# EAGLE design mobileduino 2.0 (EAGLE 6.2)
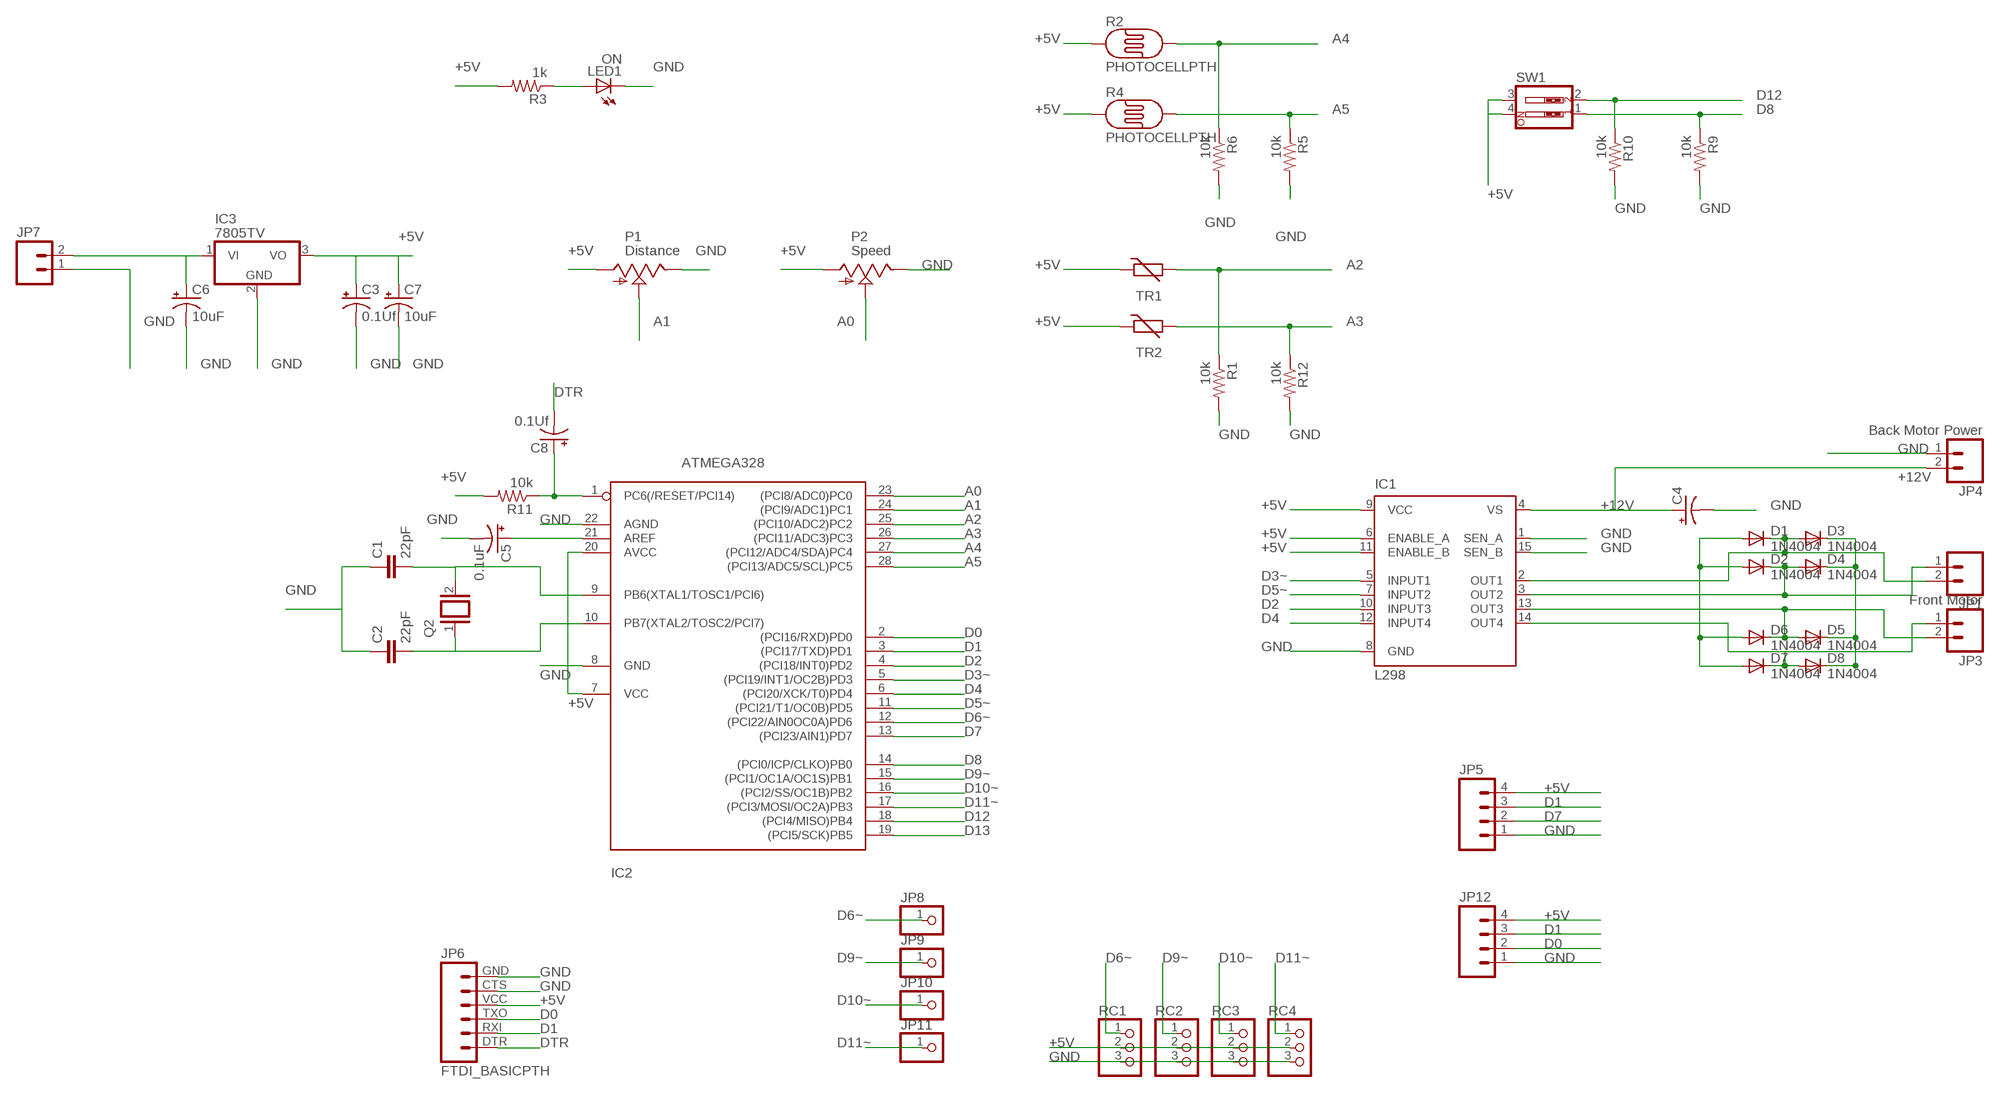
[diagram p0: schematic, sheet 1]

## Parts
C1  22pF  C5/2.5  [C5B2.5]
C2  22pF  C5/2.5  [C5B2.5]
C3  0.1Uf  CPOL-USTT2D5  [TT2D5]
C4  CPOL-USTT2D5  [TT2D5]
C5  0.1uF  CPOL-USTT2D5  [TT2D5]
C6  10uF  CPOL-USTT2D5  [TT2D5]
C7  10uF  CPOL-USTT2D5  [TT2D5]
C8  0.1Uf  CPOL-USTT2D5  [TT2D5]
D1  1N4004  [DO41-10]
D2  1N4004  [DO41-10]
D3  1N4004  [DO41-10]
D4  1N4004  [DO41-10]
D5  1N4004  [DO41-10]
D6  1N4004  [DO41-10]
D7  1N4004  [DO41-10]
D8  1N4004  [DO41-10]
IC1  L298  [MULTIWATT-15]
IC2  ATMEGA328  ATMEGA168V-10P  [DIL28-3]
IC3  7805TV  [TO220V]
JP1  M025MM  [SCREWTERMINAL-5MM-2]
JP3  Front Motor  M025MM  [SCREWTERMINAL-5MM-2]
JP4  Back Motor Power  M025MM  [SCREWTERMINAL-5MM-2]
JP5  M04PTH  [1X04]
JP6  FTDI_BASICPTH  [FTDI_BASIC]
JP7  M025MM  [SCREWTERMINAL-5MM-2]
JP8  PINHD-1X1  [1X01]
JP9  PINHD-1X1  [1X01]
JP10  PINHD-1X1  [1X01]
JP11  PINHD-1X1  [1X01]
JP12  M04PTH  [1X04]
LED1  ON  LED3MM  [LED3MM]
P1  Distance  TRIM_US-CA6V  [CA6V]
P2  Speed  TRIM_US-CA6V  [CA6V]
Q2  XTAL/S  [QS]
R1  10k  R-US_0204/2V  [0204V]
R2  PHOTOCELLPTH  [PHOTOCELL]
R3  1k  R-US_0204/2V  [0204V]
R4  PHOTOCELLPTH  [PHOTOCELL]
R5  10k  R-US_0204/2V  [0204V]
R6  10k  R-US_0204/2V  [0204V]
R9  10k  R-US_0204/2V  [0204V]
R10  10k  R-US_0204/2V  [0204V]
R11  10k  R-US_0204/2V  [0204V]
R12  10k  R-US_0204/2V  [0204V]
RC1  PINHD-1X3  [1X03]
RC2  PINHD-1X3  [1X03]
RC3  PINHD-1X3  [1X03]
RC4  PINHD-1X3  [1X03]
SW1  SW_DIP-2  [EDG-02]
TR1  THERMISTOR_R-2,5  [RS-2,5]
TR2  THERMISTOR_R-2,5  [RS-2,5]

## Nets
+5V: C3.+ C7.+ IC1.6(ENABLE_A) IC1.9(VCC) IC1.11(ENABLE_B) IC2.7(VCC) IC2.20(AVCC) IC3.3(VO) JP5.4 JP6.VCC JP12.4 P1.A P2.A R2.1 R3.2 R4.1 R11.2 RC1.2 RC2.2 RC3.2 RC4.2 SW1.3 SW1.4 TR1.1 TR2.1
+12V: C4.+ IC1.4(VS) JP4.2
A0: IC2.23((PCI8/ADC0)PC0) P2.S
A1: IC2.24((PCI9/ADC1)PC1) P1.S
A2: IC2.25((PCI10/ADC2)PC2) R1.1 TR1.2
A3: IC2.26((PCI11/ADC3)PC3) R12.1 TR2.2
A4: IC2.27((PCI12/ADC4/SDA)PC4) R2.2 R6.1
A5: IC2.28((PCI13/ADC5/SCL)PC5) R4.2 R5.1
D0: IC2.2((PCI16/RXD)PD0) JP6.TXO JP12.2
D1: IC2.3((PCI17/TXD)PD1) JP5.3 JP6.RXI JP12.3
D2: IC1.10(INPUT3) IC2.4((PCI18/INT0)PD2)
D3~: IC1.5(INPUT1) IC2.5((PCI19/INT1/OC2B)PD3)
D4: IC1.12(INPUT4) IC2.6((PCI20/XCK/T0)PD4)
D5~: IC1.7(INPUT2) IC2.11((PCI21/T1/OC0B)PD5)
D6~: IC2.12((PCI22/AIN0OC0A)PD6) JP8.1 RC1.1
D7: IC2.13((PCI23/AIN1)PD7) JP5.2
D8: IC2.14((PCI0/ICP/CLKO)PB0) R9.1 SW1.1
D9~: IC2.15((PCI1/OC1A/OC1S)PB1) JP9.1 RC2.1
D10~: IC2.16((PCI2/SS/OC1B)PB2) JP10.1 RC3.1
D11~: IC2.17((PCI3/MOSI/OC2A)PB3) JP11.1 RC4.1
D12: IC2.18((PCI4/MISO)PB4) R10.1 SW1.2
D13: IC2.19((PCI5/SCK)PB5)
DTR: C8.- JP6.DTR
GND: C1.1 C2.1 C3.- C4.- C5.- C6.- C7.- IC1.1(SEN_A) IC1.8(GND) IC1.15(SEN_B) IC2.8(GND) IC2.22(AGND) IC3.2(GND) JP4.1 JP5.1 JP6.CTS JP6.GND JP7.1 JP12.1 LED1.K(C) P1.E P2.E R1.2 R5.2 R6.2 R9.2 R10.2 R12.2 RC1.3 RC2.3 RC3.3 RC4.3
N$1: D1.C D3.A IC1.2(OUT1) JP1.2
N$2: C8.+ IC2.1(PC6(/RESET/PCI14)) R11.1
N$3: C2.2 IC2.10(PB7(XTAL2/TOSC2/PCI7)) Q2.1
N$4: D2.C D4.A IC1.3(OUT2) JP1.1
N$5: D5.A D6.C IC1.13(OUT3) JP3.2
N$6: D7.C D8.A IC1.14(OUT4) JP3.1
N$7: C6.+ IC3.1(VI) JP7.2
N$8: C1.2 IC2.9(PB6(XTAL1/TOSC1/PCI6)) Q2.2
N$9: C5.+ IC2.21(AREF)
N$18: D3.C D4.C D5.C D8.C
N$27: D1.A D2.A D6.A D7.A
N$33: LED1.A R3.1

## Library data of the parts
C1 C2 = capacitor-wima:C: CAPACITOR naming: grid - package width
C3-C8 = adafruit:CPOL-US: POLARIZED CAPACITOR, American symbol
D1-D8 = adafruit:1N4004: DIODE General purpose 1N400x type rectifier (With bigger pads) http://www.ladyada.net/library/pcb/eaglelibrary.html
IC1 = st-microelectronics:L298: DUAL FULL-BRIDGE DRIVER
IC2 = adafruit:ATMEGA168*P: MICROCONTROLLER 16 kBytes FLASH 1 kBytes SRAM 512 Bytes EEPROM USART 8-channel 10 bit ADC
IC3 = linear:78*: Positive VOLTAGE REGULATOR Source: http://cache.national.com/ds/LM/LM78L05.pdf http://www.fairchildsemi.com/ds/LM/LM7805.pdf
JP1 JP3 JP4 JP7 = SparkFun-Connectors:M02: Header 2 Standard 2-pin 0.1" header. Use with straight break away headers (SKU : PRT-00116), right angle break away headers (PRT-00553), swiss pins (PRT-00743), machine pins (PRT-00117), and female headers (PRT-00115). Molex polarized connector foot print use with SKU : PRT-08233 with associated crimp pins and housings.
JP5 JP12 = SparkFun-Connectors:M04: Header 4 Standard 4-pin 0.1" header. Use with straight break away headers (SKU : PRT-00116), right angle break away headers (PRT-00553), swiss pins (PRT-00743), machine pins (PRT-00117), and female headers (PRT-00115). Molex polarized connector foot print use with SKU : PRT-08231 with associated crimp pins and housings. 1MM SMD Version SKU: PRT-10208
JP6 = SparkFun-Connectors:FTDI_BASIC: FTDI Basic header with labels
JP8-JP11 = adafruit:PINHD-1X1: Pin header 1x1 for 0.1" spacing With round pins
LED1 = adafruit:LED: LED OSRAM: - CHIPLED LG R971, LG N971, LY N971, LG Q971, LY Q971, LO R971, LY R971 LH N974, LH R974 LS Q976, LO Q976, LY Q976 LO Q996 - Hyper CHIPLED LW Q18S LB Q993, LB Q99A, LB R99A - SideLED LS A670, LO A670, LY A670, LG A670, LP A670 LB A673, LV A673, LT A673, LW A673 LH A674 LY A675 LS A676, LA A676, LO A676, LY A676, LW A676 LS A679, LY A679, LG A679 - Hyper Micro SIDELED® LS Y876, LA Y876, LO Y876, LY Y876 LT Y87S - SmartLED LW L88C, LW L88S LB L89C, LB L89S, LG L890 LS L89K, LO L89K, LY L89K LS L896, LA L896, LO L896, LY L896 - TOPLED LS T670, LO T670, LY T670, LG T670, LP T670 LSG T670, LSP T670, LSY T670, LOP T670, LYG T670 LG T671, LOG T671, LSG T671 LB T673, LV T673, LT T673, LW T673 LH T674 LS T676, LA T676, LO T676, LY T676, LB T676, LH T676, LSB T676, LW T676 LB T67C, LV T67C, LT T67C, LS T67K, LO T67K, LY T67K, LW E67C LS E67B, LA E67B, LO E67B, LY E67B, LB E67C, LV E67C, LT E67C LW T67C LS T679, LY T679, LG T679 LS T770, LO T770, LY T770, LG T770, LP T770 LB T773, LV T773, LT T773, LW T773 LH T774 LS E675, LA E675, LY E675, LS T675 LS T776, LA T776, LO T776, LY T776, LB T776 LHGB T686 LT T68C, LB T68C - Hyper Mini TOPLED® LB M676 - Mini TOPLED Santana® LG M470 LS M47K, LO M47K, LY M47K Source: http://www.osram.convergy.de/
P1 P2 = pot:TRIM_US-: POTENTIOMETER
Q2 = special:XTAL/S: CRYSTAL
R1 R3 R5 R6 R9-R12 = adafruit:R-US_: RESISTOR, American symbol
R2 R4 = SparkFun-Sensors:PHOTOCELL: CdS photoresistor. This is a low cost way to detect light levels. Resistance decreases with more incoming light. SparkFun SKU: SEN-09088
RC1-RC4 = adafruit:PINHD-1X3: PIN HEADER
SW1 = special:SW_DIP-2: DIP SWITCH
TR1 TR2 = discrete:THERMISTOR_: Thermo Resistor

## Board
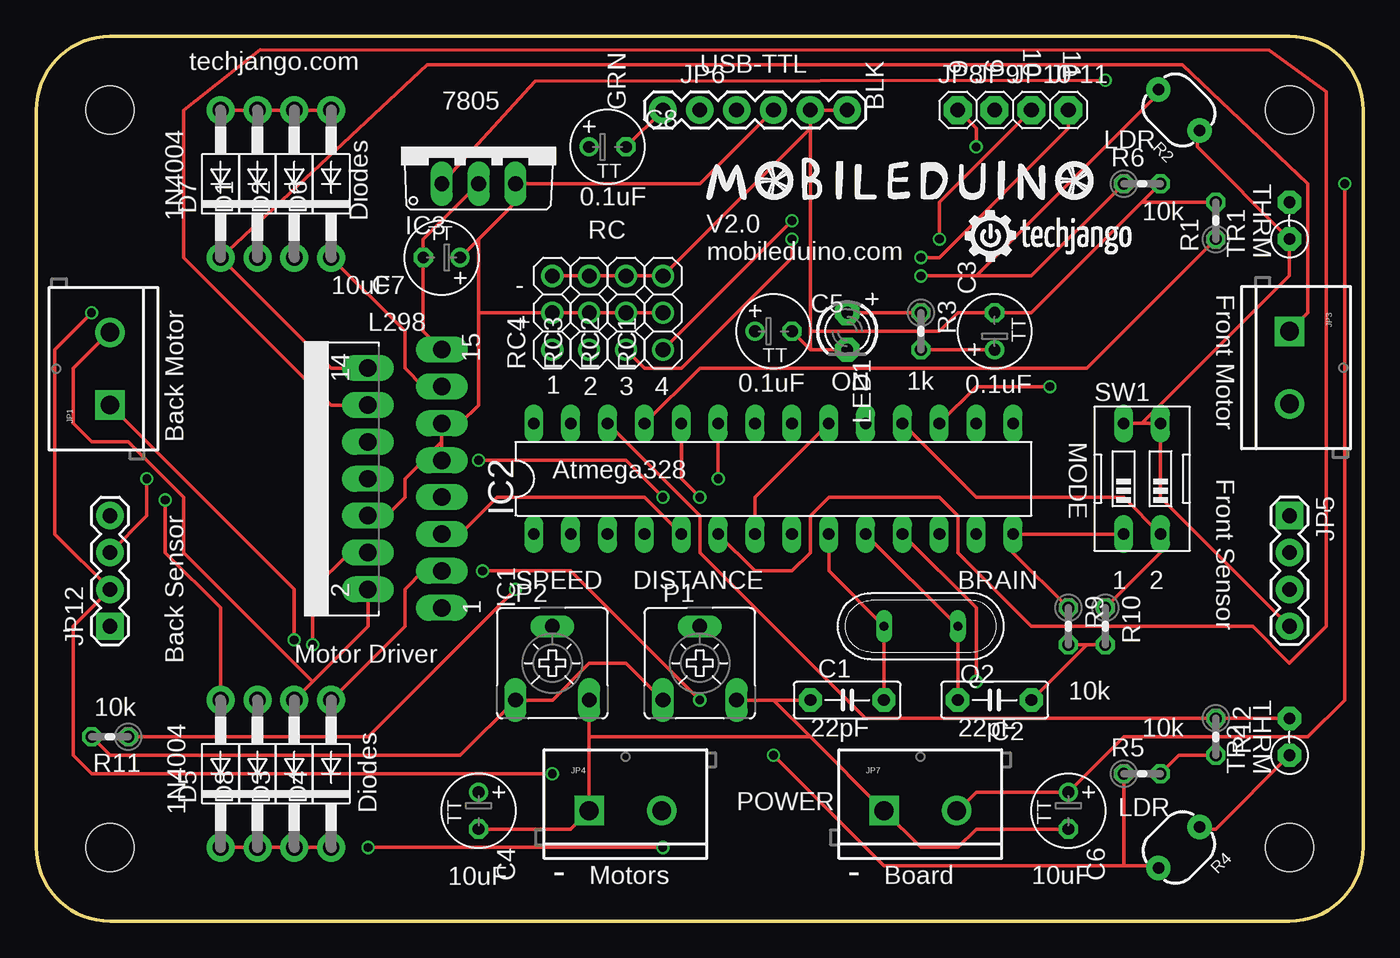
[diagram p1: board, top side]
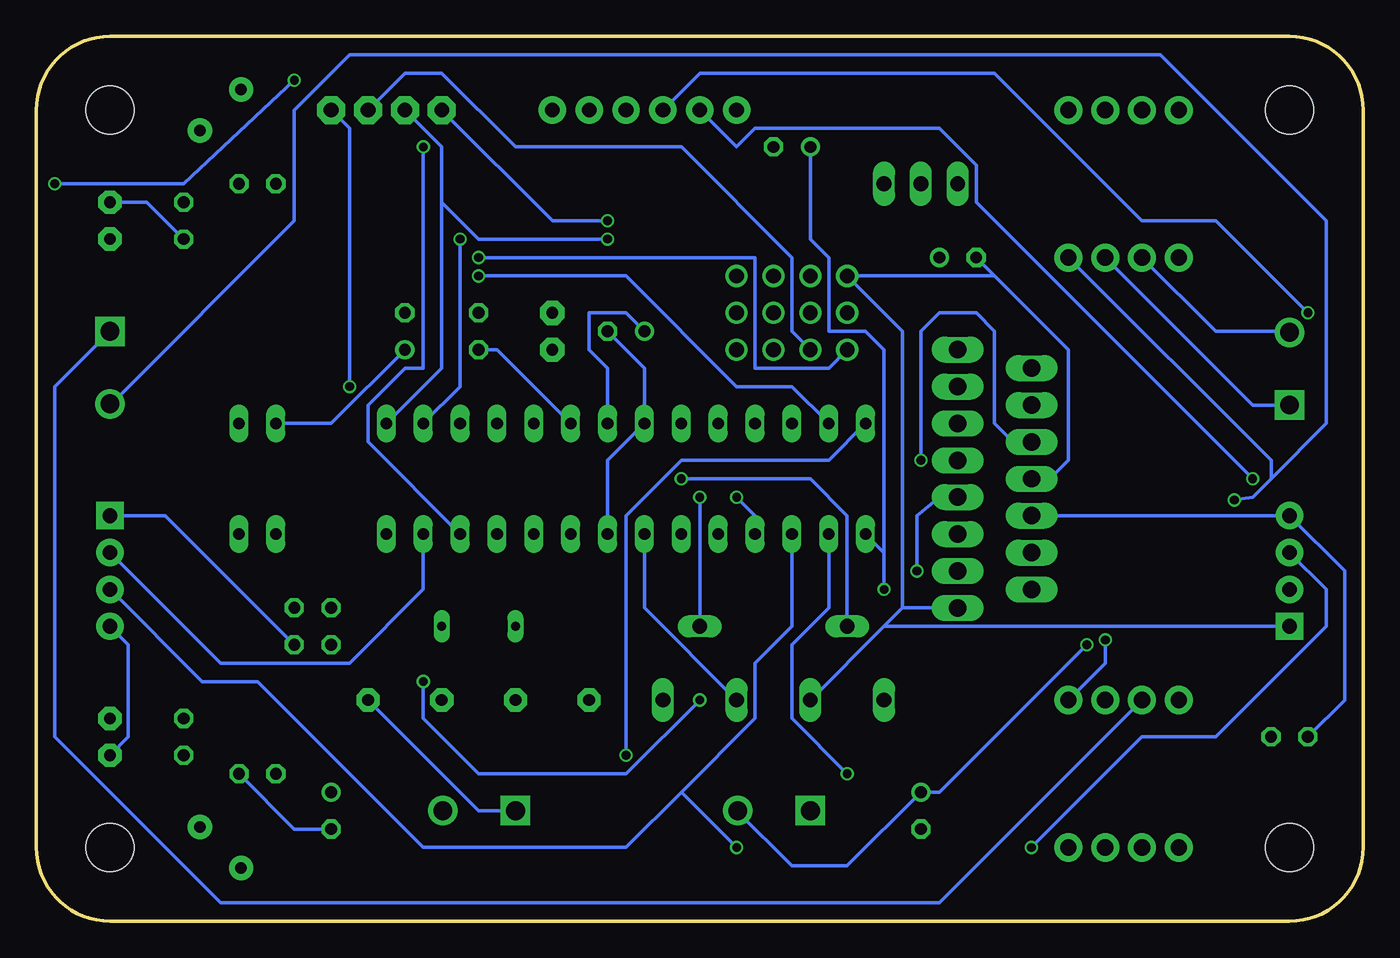
[diagram p2: board, bottom side, seen from below]

Size 91.44 x 60.96 mm. Coordinates in mm from the lower left corner, seen from the top.
Outline: 0,55.88 arc-90 5.08,60.96 86.36,60.96 arc-90 91.44,55.88 91.44,5.08 arc-90 86.36,0 5.08,0 arc-90 0,5.08 0,55.88
Copper layers (1*16): Top 0.035mm / dielectric 1.5mm / Bottom 0.035mm
Design rules: minimum track width 6mil, minimum drill 12mil, track to track 6mil, track to pad 6mil, pad to pad 6mil, via to via 6mil, smd to smd 0mil, copper to edge 10mil, drill to drill 10mil, minimum pad ring 10mil, minimum via ring 6mil, stop-mask expansion 2mil, vias tented up to drill 100mil, thermal gap 10mil

### Footprints (pad centres in the part's own frame; a part is rotated, then mirrored left to right if it is on the bottom)
C5B2.5 = drill 0.813 pad 1.6 octagon: 1 -2.54,0; 2 2.54,0
TT2D5 = drill 0.813: + -1.27,0 | drill 0.813 octagon: - 1.27,0
DO41-10 = drill 1.118 pad 1.93: A 5.08,0; C -5.08,0
MULTIWATT-15 = drill 1.2 long: 1 -8.89,-7.62; 2 -7.62,-2.54; 3 -6.35,-7.62; 4 -5.08,-2.54; 5 -3.81,-7.62; 6 -2.54,-2.54; 7 -1.27,-7.62; 8 0,-2.54; 9 1.27,-7.62; 10 2.54,-2.54; 11 3.81,-7.62; 12 5.08,-2.54; 13 6.35,-7.62; 14 7.62,-2.54; 15 8.89,-7.62
DIL28-3 = drill 0.813 long: 1 -16.51,-3.81; 2 -13.97,-3.81; 3 -11.43,-3.81; 4 -8.89,-3.81; 5 -6.35,-3.81; 6 -3.81,-3.81; 7 -1.27,-3.81; 8 1.27,-3.81; 9 3.81,-3.81; 10 6.35,-3.81; 11 8.89,-3.81; 12 11.43,-3.81; 13 13.97,-3.81; 14 16.51,-3.81; 15 16.51,3.81; 16 13.97,3.81; 17 11.43,3.81; 18 8.89,3.81; 19 6.35,3.81; 20 3.81,3.81; 21 1.27,3.81; 22 -1.27,3.81; 23 -3.81,3.81; 24 -6.35,3.81; 25 -8.89,3.81; 26 -11.43,3.81; 27 -13.97,3.81; 28 -16.51,3.81
TO220V = drill 1.016 long: 1 -2.54,-2.54; 2 0,-2.54; 3 2.54,-2.54
SCREWTERMINAL-5MM-2 = drill 1.3 pad 2.032 square: 1 0,0 | drill 1.3 pad 2.032: 2 5,0
1X04 = drill 1.016 pad 1.88 square: 1 0,0 | drill 1.016 pad 1.88: 2 2.54,0; 3 5.08,0; 4 7.62,0
FTDI_BASIC = drill 1.016 pad 1.88: CTS 10.16,0; DTR 0,0; GND 12.7,0; RXI 2.54,0; TXO 5.08,0; VCC 7.62,0
1X01 = drill 1.016 pad 1.93 octagon: 1 0,0
LED3MM = drill 0.813 pad 1.676 octagon: A -1.27,0; K 1.27,0
CA6V = drill 1.016 long: A -2.54,-2.54; E 2.54,-2.54; S 0,2.54
QS = drill 0.61 long: 1 -2.54,0; 2 2.54,0
0204V = drill 0.813 octagon: 1 -1.27,0; 2 1.27,0
PHOTOCELL = drill 0.8 pad 1.676: 1 -2,0; 2 2,0
1X03 = drill 1.016: 1 -2.54,0; 2 0,0; 3 2.54,0
EDG-02 = drill 0.813 long: 1 -1.27,-3.81; 2 1.27,-3.81; 3 1.27,3.81; 4 -1.27,3.81
RS-2,5 = drill 0.813 pad 1.6 octagon: 1 -1.27,0; 2 1.27,0
STAND-OFF = hole 3.302: 0,0

### Placement (x,y rotation side)
C1  55.88,15.24 0 top
C2  66.04,15.24 180 top
C3  66.04,40.64 90 top
C4  30.48,7.62 270 top
C5  50.8,40.64 0 top
C6  71.12,7.62 270 top
C7  27.94,45.72 180 top
C8  39.37,53.34 0 top
D1  15.24,50.8 90 top
D2  17.78,50.8 90 top
D3  17.78,10.16 90 top
D4  20.32,10.16 90 top
D5  12.7,10.16 90 top
D6  20.32,50.8 90 top
D7  12.7,50.8 90 top
D8  15.24,10.16 90 top
IC1  20.32,30.48 90 top
IC2  50.8,30.48 0 top
IC3  30.48,53.34 0 top
JP1  5.08,35.56 90 top
JP3  86.36,40.64 270 top
JP4  38.1,7.62 0 top
JP5  86.36,27.94 270 top
JP6  43.18,55.88 0 top
JP7  58.42,7.62 0 top
JP8  63.5,55.88 0 top
JP9  66.04,55.88 0 top
JP10  68.58,55.88 0 top
JP11  71.12,55.88 0 top
JP12  5.08,20.32 90 top
LED1  55.88,40.64 270 top
P1  45.72,17.78 0 top
P2  35.56,17.78 0 top
Q2  60.96,20.32 180 top
R1  81.28,48.26 90 top
R2  78.74,55.88 135 top
R3  60.96,40.64 270 top
R4  78.74,5.08 225 top
R5  76.2,10.16 0 top
R6  76.2,50.8 0 top
R9  71.12,20.32 270 top
R10  73.66,20.32 270 top
R11  5.08,12.7 180 top
R12  81.28,12.7 270 top
RC1  43.18,41.91 90 top
RC2  40.64,41.91 90 top
RC3  38.1,41.91 90 top
RC4  35.56,41.91 90 top
SW1  76.2,30.48 0 top
TR1  86.36,48.26 90 top
TR2  86.36,12.7 90 top
U$1  [STAND-OFF]  5.08,55.88 0 top
U$2  [STAND-OFF]  5.08,5.08 0 top
U$3  [STAND-OFF]  86.36,5.08 0 top
U$4  [STAND-OFF]  86.36,55.88 0 top

### Tracks (layer width: path | path; a pad name or v marks a point on that pad's centre or on a via)
+5V
  Top 0.254: R11.2 5.08,11.43 29.21,11.43 P2.A 35.56,15.24 38.1,17.78 40.64,17.78 P1.A | RC1.2 RC2.2 RC3.2 RC4.2 30.48,41.91 | 27.94,33.02 IC1.11 29.21,34.29 30.48,35.56 30.48,41.91 | 27.94,33.02 IC1.9 | 30.48,46.99 33.02,49.53 IC3.3 45.72,50.8 JP6.VCC | 30.48,46.99 C7.+ | 30.48,46.99 30.48,41.91 | IC1.6 24.13,27.94 25.4,29.21 25.4,30.48 27.94,33.02 | IC2.7 49.53,29.21 IC2.20 | R2.1 80.01,54.61 80.01,53.34 TR1.1 86.36,44.45 76.2,34.29 | TR2.1 81.28,6.35 80.01,6.35 R4.1 | 76.2,34.29 SW1.3 77.47,29.21 JP5.4 | 76.2,34.29 SW1.4 | C3.+ R3.2
  Bottom 0.254: IC1.6 JP12.4 1.27,24.13 1.27,15.24 R11.2 | P1.A 49.53,21.59 IC2.7 | SW1.4 71.12,34.29 C3.+ | TR2.1 85.09,12.7 85.09,19.05 JP5.4 | IC2.20 59.69,39.37 R3.2
+12V  (via drill 0.6)
  Top 0.254: IC1.4 21.59,25.4 19.05,22.86 v19.05,19.05
  Bottom 0.254: JP4.2 43.18,7.62 39.37,3.81 35.56,3.81 C4.+ 29.21,8.89 v19.05,19.05
A0  (via drill 0.6)
  Top 0.254: v46.99,30.48 IC2.23
  Bottom 0.254: v46.99,30.48 38.1,30.48 35.56,27.94 P2.S
A1  (via drill 0.6)
  Top 0.254: IC2.24 44.45,30.48 v45.72,29.21
  Bottom 0.254: P1.S v45.72,29.21
A2
  Top 0.254: IC2.25 45.72,38.1 72.39,38.1 R1.1
  Bottom 0.254: TR1.2 83.82,49.53 R1.1
A3
  Top 0.254: IC2.26 45.72,27.94 45.72,25.4 57.15,13.97 R12.1 TR2.2
A4  (via drill 0.6)
  Top 0.254: 64.77,44.45 68.58,44.45 R6.1 | 64.77,44.45 v60.96,44.45 | 64.77,44.45 77.47,57.15 R2.2
  Bottom 0.254: IC2.27 39.37,36.83 43.18,36.83 50.8,44.45 v60.96,44.45
A5  (via drill 0.6)
  Top 0.254: v50.8,11.43 58.42,3.81 74.93,3.81 | 74.93,3.81 77.47,3.81 R4.2 | 74.93,3.81 R5.1
  Bottom 0.254: IC2.28 36.83,31.75 46.99,31.75 50.8,27.94 v50.8,11.43
D0  (via drill 0.6)
  Top 0.254: v35.56,10.16 3.81,10.16 2.54,11.43 2.54,20.32 JP12.2 1.27,26.67 1.27,39.37 v3.81,41.91
  Bottom 0.254: IC2.2 36.83,21.59 39.37,19.05 39.37,13.97 v35.56,10.16 | JP6.TXO 45.72,58.42 25.4,58.42 15.24,48.26 10.16,48.26 v3.81,41.91
D1  (via drill 0.6)
  Top 0.254: JP12.3 7.62,27.94 v7.62,30.48 | v22.86,5.08 v43.18,5.08
  Bottom 0.254: IC2.3 39.37,20.32 41.91,17.78 41.91,13.97 46.99,8.89 | 46.99,8.89 50.8,5.08 64.77,5.08 76.2,16.51 80.01,16.51 JP5.3 | v7.62,30.48 26.67,49.53 26.67,52.07 29.21,54.61 41.91,54.61 43.18,53.34 JP6.RXI | v43.18,5.08 46.99,8.89 | v22.86,5.08 15.24,12.7 10.16,12.7 2.54,20.32 2.54,22.86 JP12.3
D2  (via drill 0.6)
  Top 0.254: v43.18,29.21 40.64,31.75 v30.48,31.75
  Bottom 0.254: IC2.4 41.91,27.94 v43.18,29.21 | v30.48,31.75 30.48,40.64 29.21,41.91 26.67,41.91 25.4,40.64 25.4,34.29 24.13,33.02 IC1.10
D3~
  Top 0.254: IC2.5 41.91,29.21 31.75,29.21 29.21,26.67 IC1.5
D4
  Top 0.254: IC2.6 49.53,24.13 52.07,24.13 53.34,25.4 53.34,27.94 54.61,29.21 62.23,29.21 63.5,27.94 63.5,25.4 68.58,20.32 83.82,20.32 86.36,17.78 88.9,20.32 88.9,57.15 84.97,60.01 15.41,60.02 10.16,55.88 10.16,45.72 20.32,35.56 IC1.12
D5~  (via drill 0.6)
  Top 0.254: IC2.11 64.77,21.59 v64.77,16.51 | v45.72,15.24 36.83,24.13 v30.76,24.13
  Bottom 0.254: v64.77,16.51 64.77,13.97 60.96,10.16 50.8,10.16 v45.72,15.24 | v30.76,24.13 30.76,27.92 29.21,29.21 IC1.7
D6~  (via drill 0.6)
  Top 0.254: v64.77,53.34 64.77,54.61 JP8.1 | v52.07,48.26 RC1.1
  Bottom 0.254: IC2.12 68.58,33.02 68.58,35.56 66.04,38.1 64.77,38.1 v64.77,53.34 | v52.07,48.26 55.88,48.26 JP8.1
D7
  Bottom 0.254: IC2.13 64.77,22.86 69.85,17.78 78.74,17.78 JP5.2
D8
  Top 0.254: R9.1 67.31,25.4 IC2.14 SW1.1
D9~  (via drill 0.6)
  Top 0.254: RC2.1 41.91,38.1 44.45,38.1 52.07,45.72 v52.07,46.99
  Bottom 0.254: IC2.15 63.5,38.1 63.5,49.53 | 63.5,49.53 63.5,53.34 JP9.1 | v52.07,46.99 60.96,46.99 63.5,49.53
D10~  (via drill 0.6)
  Top 0.254: v62.23,46.99 62.23,49.53 JP10.1
  Bottom 0.254: IC2.16 62.23,36.83 v62.23,46.99 | RC3.1 39.37,40.64 39.37,45.72 46.99,53.34 58.42,53.34 63.5,58.42 66.04,58.42 JP10.1
D11~  (via drill 0.6)
  Top 0.254: IC2.17 64.77,36.83 v69.85,36.83 | v60.96,45.72 62.23,45.72 71.12,54.61 JP11.1
  Bottom 0.254: v69.85,36.83 69.85,54.61 JP11.1 | RC4.1 36.83,38.1 41.91,38.1 41.91,45.72 v60.96,45.72
D12
  Top 0.254: IC2.18 64.77,29.21 74.93,29.21 SW1.2 77.47,25.4 R10.1
DTR
  Top 0.254: JP6.DTR C8.-
GND
  Top 0.254: RC4.3 RC3.3 RC2.3 RC1.3 53.34,54.61 | IC1.15 26.67,40.64 C7.- 26.67,46.99 IC3.2 | R6.2 76.2,49.53 | 76.2,49.53 68.58,41.91 C3.- 63.5,41.91 62.23,40.64 53.34,40.64 | 76.2,49.53 R1.2 | JP6.GND JP6.CTS 53.34,54.61 | 53.34,39.37 LED1.K | C5.- 53.34,39.37 | 53.34,39.37 53.34,40.64 | 53.34,40.64 53.34,54.61 | C4.- 36.83,6.35 JP4.1 38.1,12.7 | 38.1,12.7 P2.E | R10.2 72.39,19.05 | 72.39,19.05 R9.2 | 72.39,19.05 C2.1 | R12.2 78.74,11.43 R5.2 | C1.1 50.8,15.24 | 50.8,15.24 P1.E | 50.8,15.24 53.34,12.7 | 53.34,12.7 JP7.1 60.96,5.08 63.5,5.08 64.77,6.35 C6.- | 53.34,12.7 38.1,12.7
  Bottom 0.254: IC1.8 21.59,30.48 20.32,31.75 20.32,39.37 25.4,44.45 | C7.- 25.4,44.45 | 25.4,44.45 RC4.3 31.75,40.64 31.75,21.59 | C5.- 49.53,38.1 IC2.22 52.07,31.75 IC2.8 | 31.75,21.59 IC1.1 | P2.E 33.02,20.32 | 33.02,20.32 31.75,21.59 | 33.02,20.32 JP12.1 | JP5.1 82.55,27.94 R10.2 | C6.- 73.66,6.35 R5.2 | C2.1 60.96,7.62 JP7.1
N$1
  Top 0.254: IC1.2 22.86,20.32 19.05,16.51 | D3.A 19.05,16.51 | 19.05,16.51 10.16,25.4 10.16,29.21 6.35,33.02 3.81,33.02 2.54,34.29 2.54,38.1 5.08,40.64 JP1.2
  Bottom 0.254: D1.C 10.16,40.64 5.08,40.64 JP1.2
N$2  (via drill 0.6)
  Top 0.254: R11.1 22.86,12.7 v33.02,22.86
  Bottom 0.254: 33.02,25.4 v33.02,22.86 | IC2.1 33.02,25.4 | C8.+ 38.1,46.99 36.83,45.72 36.83,40.64 34.29,40.64 33.02,39.37 33.02,25.4
N$3
  Top 0.254: C2.2 Q2.1 IC2.10
N$4  (via drill 0.6)
  Top 0.254: IC1.3 26.67,24.13 25.4,22.86 25.4,20.32 D4.A | v17.76,19.38 17.78,22.86 JP1.1
  Bottom 0.254: D2.C 7.62,35.56 JP1.1 | D4.A 17.78,17.78 v17.76,19.38
N$5  (via drill 0.6)
  Top 0.254: IC1.13 26.67,36.83 25.4,38.1 25.4,40.64 D6.C | D5.A 12.7,21.59 8.89,25.4 v8.89,29.02
  Bottom 0.254: v8.89,29.02 7.62,29.21 6.35,30.48 | 6.35,30.48 6.35,31.75 D6.C | 6.35,30.48 2.54,34.29 2.54,48.26 13.97,59.69 69.85,59.69 73.66,55.88 73.66,48.26 86.36,35.56 JP3.2
N$6
  Top 0.254: IC1.14 20.32,38.1 D7.C 26.92,59 78.99,59 87.63,50.8 87.63,41.91 JP3.1
  Bottom 0.254: D8.A 29.21,1.27 78.74,1.27 90.17,12.7 90.17,36.83 JP3.1
N$7  (via drill 0.6)
  Top 0.254: JP7.2 63.5,7.62 64.77,8.89 C6.+ 74.93,12.7 87.63,12.7 90.17,15.24 v90.17,50.8 | IC3.1 34.38,57.88 v73.66,57.93
  Bottom 0.254: v73.66,57.93 81.28,50.8 v90.17,50.8
N$8
  Top 0.254: C1.2 Q2.2 54.61,24.13 IC2.9
N$9
  Bottom 0.254: IC2.21 52.07,38.1 53.34,39.37 53.34,41.91 50.8,41.91 C5.+
N$18
  Top 0.254: D5.C D8.C D3.C D4.C
N$27
  Top 0.254: D7.A D1.A D2.A D6.A
N$33
  Top 0.254: LED1.A R3.1

### Text on the board
tPlace: 10 | 11 | techjango.com | 6 | 9 | USB-TTL | 7805 | GRN | BLK | LDR | THRM | 0.1uF | 1N4004 | Diodes | RC | 10k | V2.0 | mobileduino.com | 10uF | - | Front Motor | L298 | + | ON | 1k | 1 | 2 | 3 | 4 | 0.1uF | 0.1uF | Back Motor | MODE | Atmega328 | Front Sensor | - | SPEED | DISTANCE | BRAIN | 1 | 2 | - | Back Sensor | Motor Driver | 10k | 10k | THRM | 22pF | 22pF | 10k | POWER | 1N4004 | Diodes | LDR | - | Motors | - | Board | 10uF | 10uF | C:/Users/Azam/Desktop/Logo.bmp | C:/Users/Azam/Desktop/logo_jango.bmp | C:/Users/Azam/Desktop/logo_jango.bmp